# EAGLE design Peripherals (EAGLE 9.0.0)
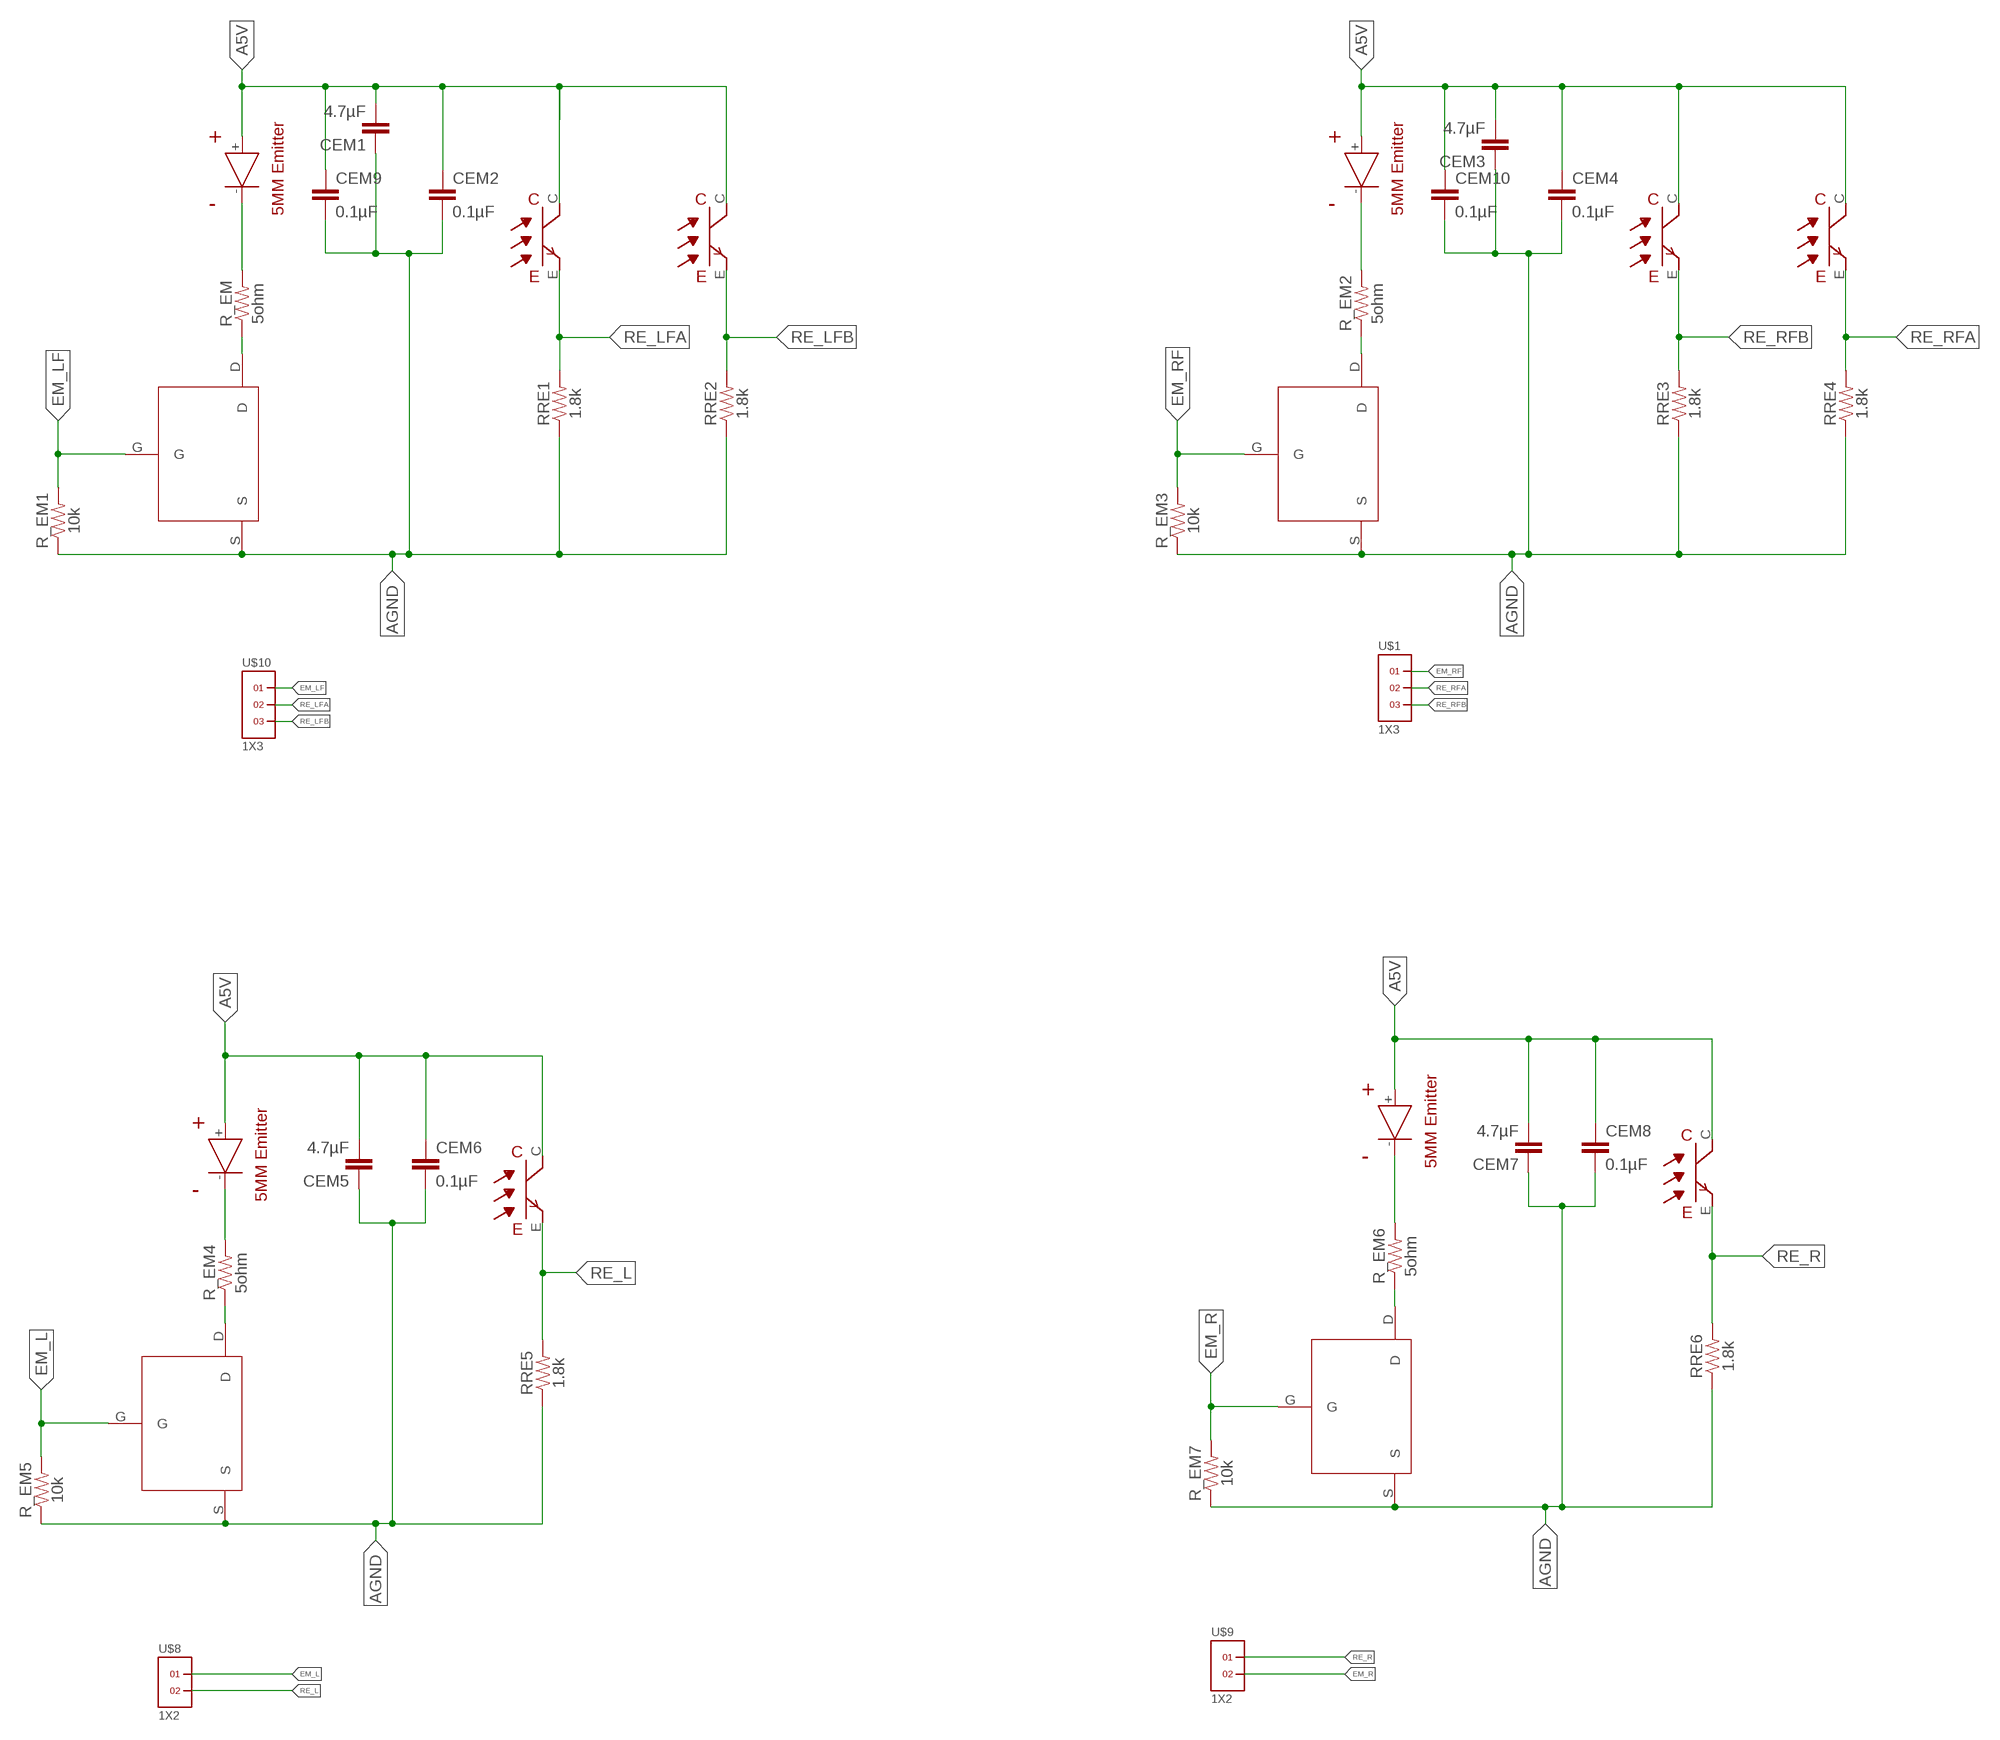
[diagram p0: schematic, sheet 1, part 1 of 2]
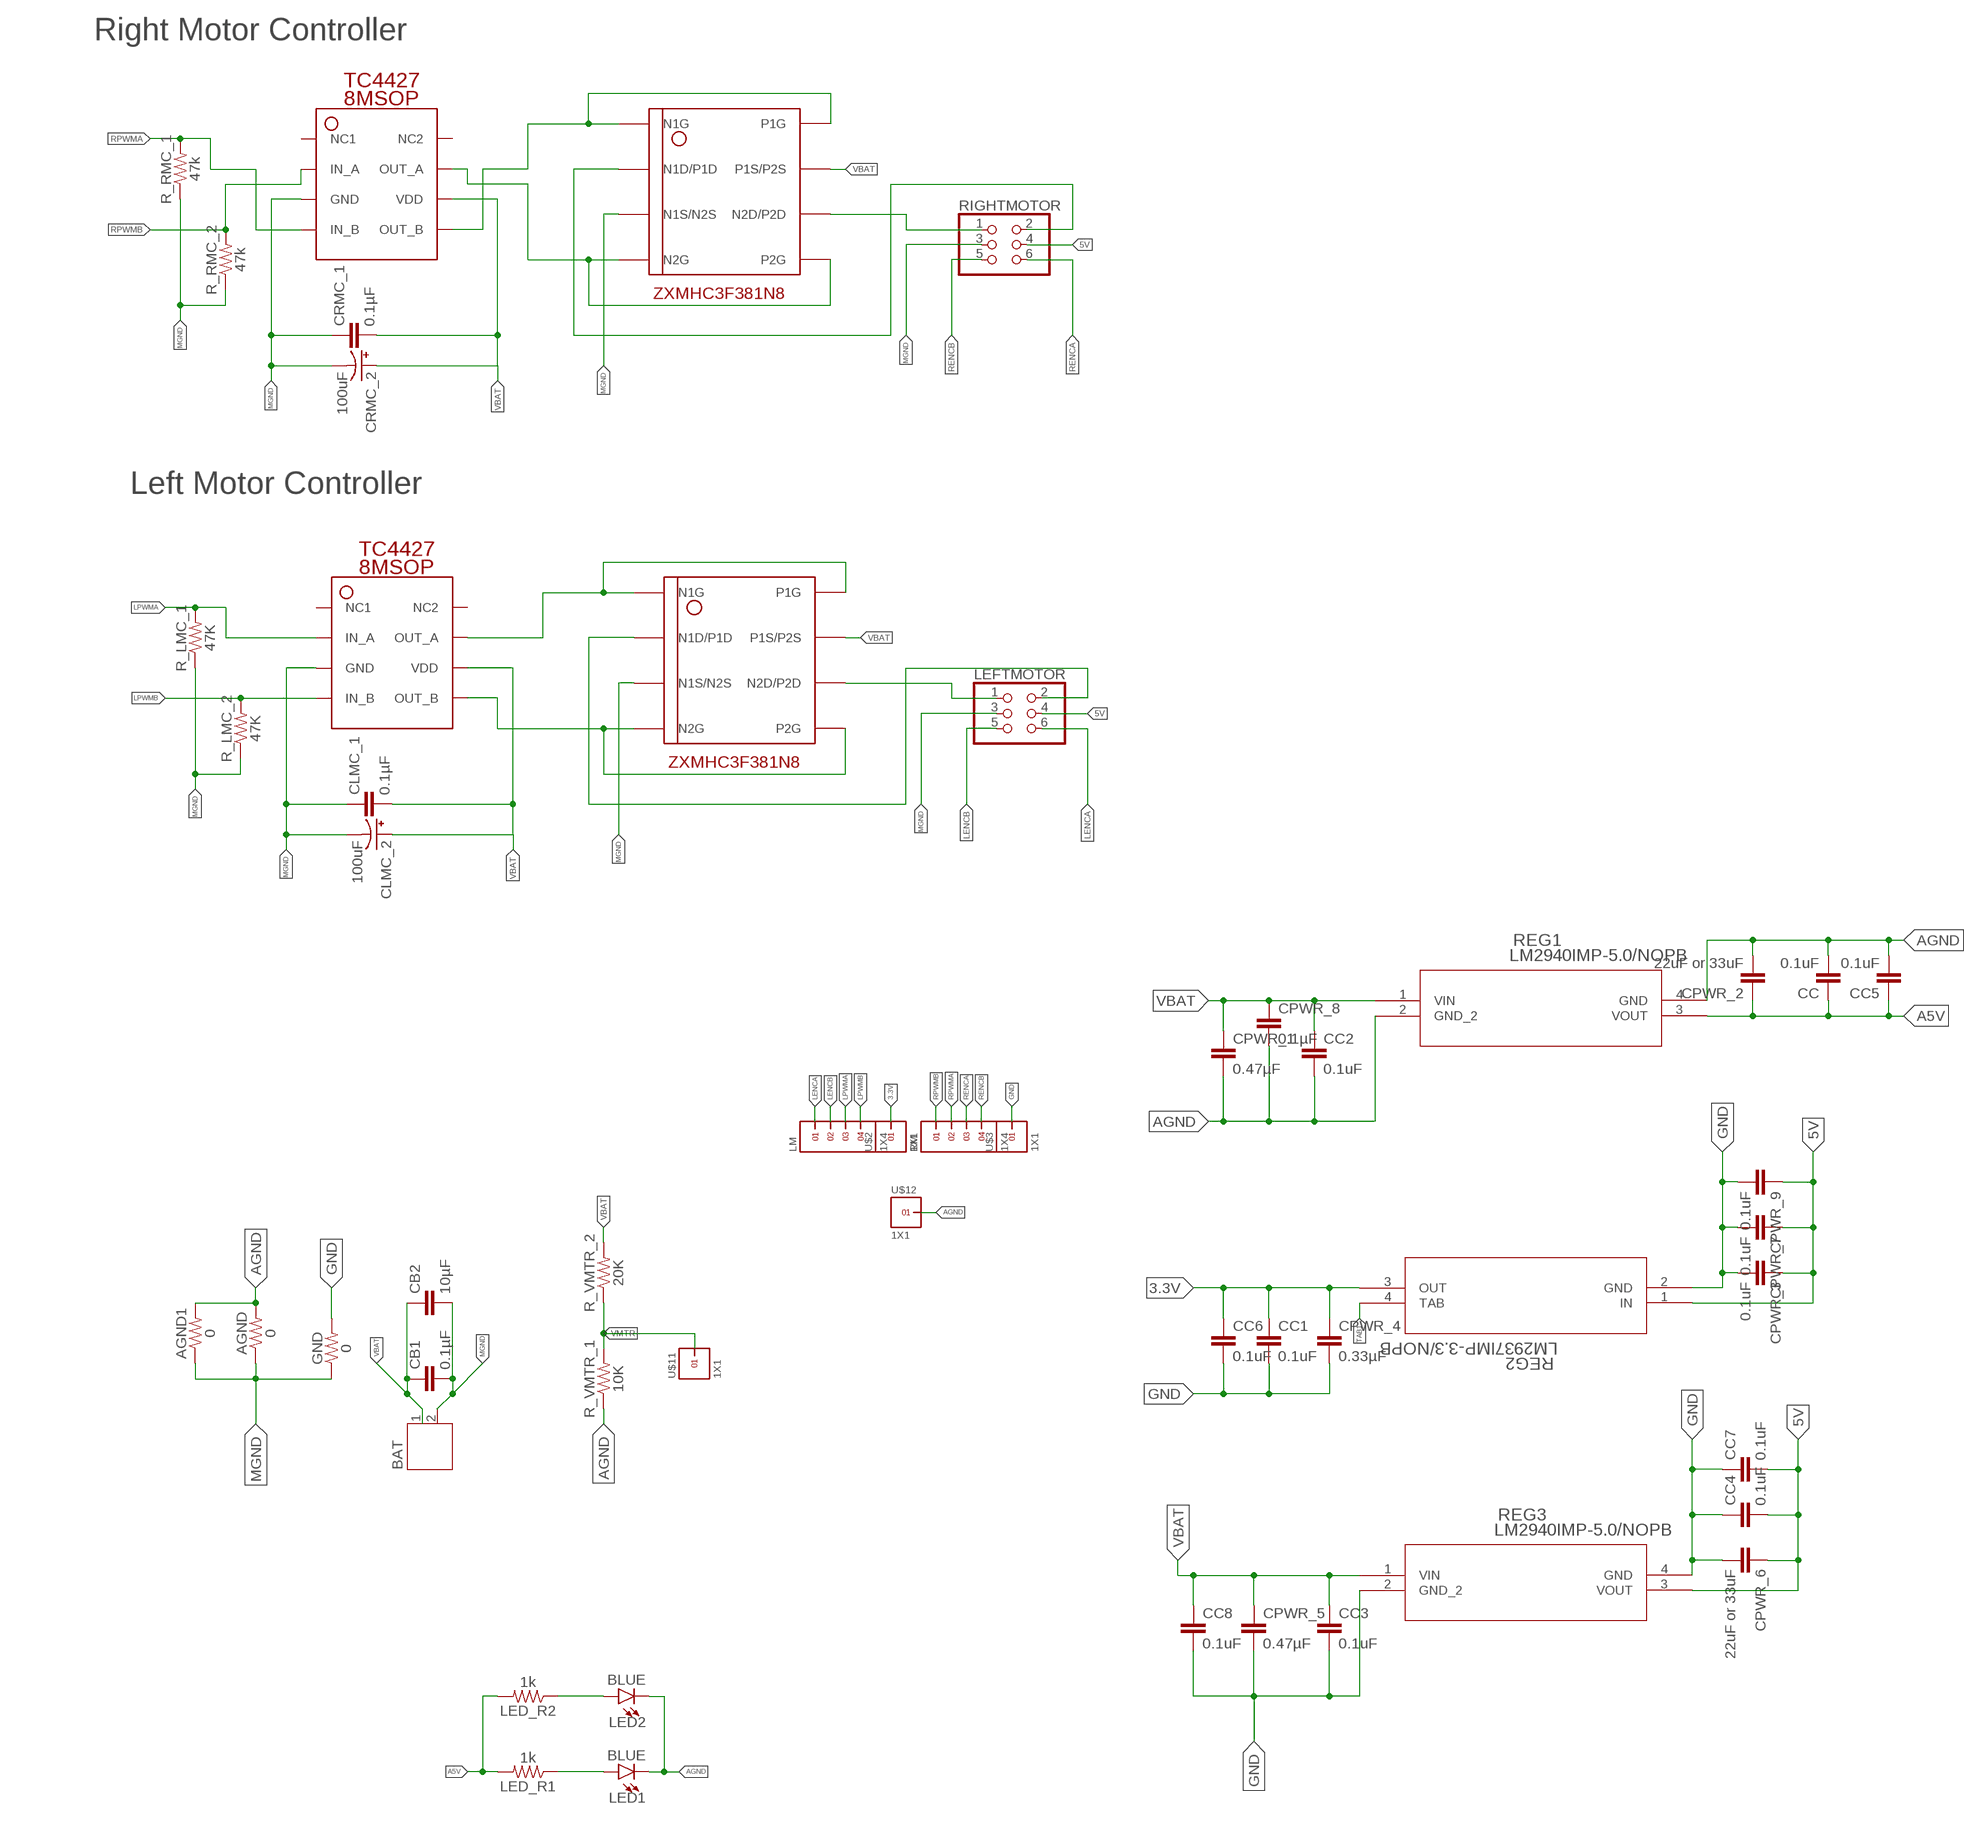
[diagram p1: schematic, sheet 1, part 2 of 2]

## Parts
AGND  0  0.75OHM-0805-1/4W-1%  [0805]
AGND1  0  0.75OHM-0805-1/4W-1%  [0805]
BAT  JST-PH2  [JST-PH2]
CB1  0.1µF  0.33UF/330NF-0805-50V-10%  [0805]
CB2  10µF  0.33UF/330NF-0805-50V-10%  [0805]
CC  0.1uF  0.33UF/330NF-0805-50V-10%  [0805]
CC1  0.1uF  0.33UF/330NF-0805-50V-10%  [0805]
CC2  0.1uF  0.33UF/330NF-0805-50V-10%  [0805]
CC3  0.1uF  0.33UF/330NF-0805-50V-10%  [0805]
CC4  0.1uF  0.33UF/330NF-0805-50V-10%  [0805]
CC5  0.1uF  0.33UF/330NF-0805-50V-10%  [0805]
CC6  0.1uF  0.33UF/330NF-0805-50V-10%  [0805]
CC7  0.1uF  0.33UF/330NF-0805-50V-10%  [0805]
CC8  0.1uF  0.33UF/330NF-0805-50V-10%  [0805]
CEM1  4.7µF  0.33UF/330NF-0805-50V-10%  [0805]
CEM2  0.1µF  0.33UF/330NF-0805-50V-10%  [0805]
CEM3  4.7µF  0.33UF/330NF-0805-50V-10%  [0805]
CEM4  0.1µF  0.33UF/330NF-0805-50V-10%  [0805]
CEM5  4.7µF  0.33UF/330NF-0805-50V-10%  [0805]
CEM6  0.1µF  0.33UF/330NF-0805-50V-10%  [0805]
CEM7  4.7µF  0.33UF/330NF-0805-50V-10%  [0805]
CEM8  0.1µF  0.33UF/330NF-0805-50V-10%  [0805]
CEM9  0.1µF  0.33UF/330NF-0805-50V-10%  [0805]
CEM10  0.1µF  0.33UF/330NF-0805-50V-10%  [0805]
CLMC_1  0.1µF  0.33UF/330NF-0805-50V-10%  [0805]
CLMC_2  100uF  100UF-POLAR-EIA7343-10V-10%(TANT)  [EIA7343]
CPWR_1  0.47µF  0.33UF/330NF-0805-50V-10%  [0805]
CPWR_2  22uF or 33uF  0.33UF/330NF-0805-50V-10%  [0805]
CPWR_3  0.1uF  0.33UF/330NF-0805-50V-10%  [0805]
CPWR_4  0.33µF  0.33UF/330NF-0805-50V-10%  [0805]
CPWR_5  0.47µF  0.33UF/330NF-0805-50V-10%  [0805]
CPWR_6  22uF or 33uF  0.33UF/330NF-0805-50V-10%  [0805]
CPWR_7  0.1uF  0.33UF/330NF-0805-50V-10%  [0805]
CPWR_8  0.1µF  0.33UF/330NF-0805-50V-10%  [0805]
CPWR_9  0.1uF  0.33UF/330NF-0805-50V-10%  [0805]
CRMC_1  0.1µF  0.33UF/330NF-0805-50V-10%  [0805]
CRMC_2  100uF  100UF-POLAR-EIA7343-10V-10%(TANT)  [EIA7343]
EM_L  EMITTER  [EMITTER]
EM_LF  EMITTER  [EMITTER]
EM_R  EMITTER  [EMITTER]
EM_RF  EMITTER  [EMITTER]
GND  0  0.75OHM-0805-1/4W-1%  [0805]
LED1  BLUE  LED-BLUE1206  [LED-1206]
LED2  BLUE  LED-BLUE1206  [LED-1206]
LED_R1  1k  0.75OHM-0805-1/4W-1%  [0805]
LED_R2  1k  0.75OHM-0805-1/4W-1%  [0805]
LEFTMOTOR  PINHD-2X3  [2X03]
LM  1X4  [1X4]
R_EM  5ohm  0.75OHM-0805-1/4W-1%  [0805]
R_EM1  10k  0.75OHM-0805-1/4W-1%  [0805]
R_EM2  5ohm  0.75OHM-0805-1/4W-1%  [0805]
R_EM3  10k  0.75OHM-0805-1/4W-1%  [0805]
R_EM4  5ohm  0.75OHM-0805-1/4W-1%  [0805]
R_EM5  10k  0.75OHM-0805-1/4W-1%  [0805]
R_EM6  5ohm  0.75OHM-0805-1/4W-1%  [0805]
R_EM7  10k  0.75OHM-0805-1/4W-1%  [0805]
R_LMC_1  47K  0.75OHM-0805-1/4W-1%  [0805]
R_LMC_2  47K  0.75OHM-0805-1/4W-1%  [0805]
R_RMC_1  47k  0.75OHM-0805-1/4W-1%  [0805]
R_RMC_2  47k  0.75OHM-0805-1/4W-1%  [0805]
R_VMTR_1  10K  0.75OHM-0805-1/4W-1%  [0805]
R_VMTR_2  20K  0.75OHM-0805-1/4W-1%  [0805]
RE_L  RECEIVER  [RECEIVER]
RE_LFA  RECEIVER  [RECEIVER]
RE_LFB  RECEIVER  [RECEIVER]
RE_R  RECEIVER  [RECEIVER]
RE_RFA  RECEIVER  [RECEIVER]
RE_RFB  RECEIVER  [RECEIVER]
REG1  LM2940IMP-5.0/NOPB  [MP04A]
REG2  LM2937IMP-3.3/NOPB  [MP04A]
REG3  LM2940IMP-5.0/NOPB  [MP04A]
RIGHTMOTOR  PINHD-2X3  [2X03]
RM  1X4  [1X4]
RRE1  1.8k  0.75OHM-0805-1/4W-1%  [0805]
RRE2  1.8k  0.75OHM-0805-1/4W-1%  [0805]
RRE3  1.8k  0.75OHM-0805-1/4W-1%  [0805]
RRE4  1.8k  0.75OHM-0805-1/4W-1%  [0805]
RRE5  1.8k  0.75OHM-0805-1/4W-1%  [0805]
RRE6  1.8k  0.75OHM-0805-1/4W-1%  [0805]
U$1  1X3  [1X3]
U$2  1X1  [1X1]
U$3  1X1  [1X1]
U$4  MCH3474  [MCH3474]
U$5  MCH3474  [MCH3474]
U$6  MCH3474  [MCH3474]
U$7  MCH3474  [MCH3474]
U$8  1X2  [1X2]
U$9  1X2  [1X2]
U$10  1X3  [1X3]
U$11  1X1  [1X1]
U$12  1X1  [1X1]
U$15  TC4427(8MSOP)  [TC4427(8MSOP)]
U$16  ZXMHC3F381N8  [ZXMHC3F381N8]
U$17  TC4427(8MSOP)  [TC4427(8MSOP)]
U$18  ZXMHC3F381N8  [ZXMHC3F381N8]

## Nets
3.3V: CC1.1 CC6.1 CPWR_4.1 REG2.3(OUT) U$2.1
5V: CC4.2 CC7.2 CPWR_3.1 CPWR_6.1 CPWR_7.1 CPWR_9.1 LEFTMOTOR.4 REG2.1(IN) REG3.3(VOUT) RIGHTMOTOR.4
A5V: CC5.1 CC.1 CEM1.2 CEM2.1 CEM3.2 CEM4.1 CEM5.2 CEM6.1 CEM7.2 CEM8.1 CEM9.1 CEM10.1 CPWR_2.1 EM_L.+ EM_LF.+ EM_R.+ EM_RF.+ LED_R1.2 LED_R2.2 RE_L.C RE_LFA.C RE_LFB.C RE_R.C RE_RFA.C RE_RFB.C REG1.3(VOUT)
AGND: AGND1.2 AGND.2 CC2.2 CC5.2 CC.2 CEM1.1 CEM2.2 CEM3.1 CEM4.2 CEM5.1 CEM6.2 CEM7.1 CEM8.2 CEM9.2 CEM10.2 CPWR_1.2 CPWR_2.2 CPWR_8.2 LED1.C LED2.C R_EM1.1 R_EM3.1 R_EM5.1 R_EM7.1 R_VMTR_1.1 REG1.2(GND_2) REG1.4(GND) RRE1.1 RRE2.1 RRE3.1 RRE4.1 RRE5.1 RRE6.1 U$4.S U$5.S U$6.S U$7.S U$12.1
EM_L: R_EM5.2 U$4.G U$8.1
EM_LF: R_EM1.2 U$5.G U$10.1
EM_R: R_EM7.2 U$7.G U$9.2
EM_RF: R_EM3.2 U$1.1 U$6.G
EMD_L: EM_L.- R_EM4.2
GND: CC1.2 CC3.2 CC4.1 CC6.2 CC7.1 CC8.2 CPWR_3.2 CPWR_4.2 CPWR_5.2 CPWR_6.2 CPWR_7.2 CPWR_9.2 GND.2 REG2.2(GND) REG3.2(GND_2) REG3.4(GND) U$3.1
L: LEFTMOTOR.2 U$16.N1D/P1D
LENCA: LEFTMOTOR.6 LM.1
LENCB: LEFTMOTOR.5 LM.2
LPWMA: LM.3 R_LMC_1.2 U$15.IN_A
LPWMB: LM.4 R_LMC_2.2 U$15.IN_B
MGND: AGND1.1 AGND.1 BAT.2 CB1.2 CB2.2 CLMC_1.1 CLMC_2.C(-) CRMC_1.1 CRMC_2.C(-) GND.1 LEFTMOTOR.3 R_LMC_1.1 R_LMC_2.1 R_RMC_1.1 R_RMC_2.1 RIGHTMOTOR.3 U$15.GND U$16.N1S/N2S U$17.GND U$18.N1S/N2S
N$1: R_EM.1 U$5.D
N$2: R_EM2.1 U$6.D
N$3: R_EM4.1 U$4.D
N$4: R_EM6.1 U$7.D
N$5: EM_LF.- R_EM.2
N$6: EM_RF.- R_EM2.2
N$7: EM_R.- R_EM6.2
N$8: LED1.A LED_R1.1
N$9: LEFTMOTOR.1 U$16.N2D/P2D
N$10: LED2.A LED_R2.1
N$36: RIGHTMOTOR.1 U$18.N2D/P2D
OUT_A: U$15.OUT_A U$16.N1G U$16.P1G
OUT_B: U$15.OUT_B U$16.N2G U$16.P2G
OUTA: U$17.OUT_B U$18.N1G U$18.P1G
OUTB: U$17.OUT_A U$18.N2G U$18.P2G
R: RIGHTMOTOR.2 U$18.N1D/P1D
RE_L: RE_L.E RRE5.2 U$8.2
RE_LFA: RE_LFA.E RRE1.2 U$10.2
RE_LFB: RE_LFB.E RRE2.2 U$10.3
RE_R: RE_R.E RRE6.2 U$9.1
RE_RFA: RE_RFB.E RRE4.2 U$1.2
RE_RFB: RE_RFA.E RRE3.2 U$1.3
RENCA: RIGHTMOTOR.6 RM.3
RENCB: RIGHTMOTOR.5 RM.4
RPWMA: R_RMC_1.2 RM.2 U$17.IN_B
RPWMB: R_RMC_2.2 RM.1 U$17.IN_A
TAB1: REG2.4(TAB)
VBAT: BAT.1 CB1.1 CB2.1 CC2.1 CC3.1 CC8.1 CLMC_1.2 CLMC_2.A(+) CPWR_1.1 CPWR_5.1 CPWR_8.1 CRMC_1.2 CRMC_2.A(+) R_VMTR_2.2 REG1.1(VIN) REG3.1(VIN) U$15.VDD U$16.P1S/P2S U$17.VDD U$18.P1S/P2S
VMTR: R_VMTR_1.2 R_VMTR_2.1 U$11.1
Unconnected: U$15.NC1 U$15.NC2 U$17.NC1 U$17.NC2

## Notes on the sheet
- Right Motor Controller
- Left Motor Controller

## Library data of the parts
AGND AGND1 GND LED_R1 LED_R2 R_EM R_EM1-R_EM7 R_LMC_1 R_LMC_2 R_RMC_1 R_RMC_2 R_VMTR_1 R_VMTR_2 RRE1-RRE6 = SparkFun-Resistors:0.75OHM: 0.75Ω resistor A resistor is a passive two-terminal electrical component that implements electrical resistance as a circuit element. Resistors act to reduce current flow, and, at the same time, act to lower voltage levels within circuits. - Wikipedia; PROD_ID: RES-08474; VALUE: 0.75
BAT = jst-ph:JST-PH2
CB1 CB2 CC CC1-CC8 CEM1-CEM10 CLMC_1 CPWR_1-CPWR_3 CPWR_5-CPWR_9 CRMC_1 = SparkFun-Capacitors:0.33UF/330NF: 0.33µF/330nF ceramic capacitors A capacitor is a passive two-terminal electrical component used to store electrical energy temporarily in an electric field.; PROD_ID: CAP-08469; VALUE: 0.33µF
CLMC_2 CRMC_2 = SparkFun-Capacitors:100UF-POLAR: 100µF polarized capacitors A capacitor is a passive two-terminal electrical component used to store electrical energy temporarily in an electric field.; PROD_ID: CAP-07890
CPWR_4 = SparkFun-Capacitors:0.33UF/330NF: 0.33µF/330nF ceramic capacitors A capacitor is a passive two-terminal electrical component used to store electrical energy temporarily in an electric field.; PROD_ID: CAP-08469
EM_L EM_LF EM_R EM_RF = sfh4550 & teft4300:EMITTER
LED1 LED2 = SparkFun-LED:LED-BLUE: Blue SMD LED Used in manufacturing of various products at SparkFun Packages: 0603 - SMD 0603 package [Product Link] <http://www.digikey.com/product-detail/en/SMLE12BC7TT86/511-1589-2-ND/1641808> 1206 - SMD1206 package [Product Link] <http://www.digikey.com/product-detail/en/lite-on-inc/LTST-C150TBKT/160-1643-1-ND/573584> SparkFun Products: ESP8266 Thing-Dev Board <https://www.sparkfun.com/products/13711> RedBoard <https://www.sparkfun.com/products/12757>; PROD_ID: DIO-09911
LEFTMOTOR RIGHTMOTOR = pinhead:PINHD-2X3: PIN HEADER
LM RM = headers(2mm):1X4
RE_L RE_LFA RE_LFB RE_R RE_RFA RE_RFB = sfh4550 & teft4300:RECEIVER
REG1 REG3 = LM2940IMP-5.0:LM2940IMP-5.0/NOPB; 3D_LIBRARY_NAME: National_LDO; BASE_PN: LM2940; COMP: TypeLDO; COPYRIGHT: Copyright C 2015 Accelerated Designs. All rights reserved; LIBRARY: ReferenceLM2940IMP; MANUFACTURER_PART_NUMBER: LM2940IMP5.0NOPB; PIN: Count4; SYMBOL: NameLM2940IMP50; TYPE: LM2940IMP5.0; VENDOR: National Semiconductor; VERSION: 1
REG2 = LM2937IMP-3.3:LM2937IMP-3.3/NOPB; COPYRIGHT: Copyright C 2015 Accelerated Designs. All rights reserved; MANUFACTURER_PART_NUMBER: lm2937imp3_3nopb; VENDOR: National Semiconductor
U$1 U$10 = headers(2mm):1X3
U$2 U$3 U$11 U$12 = headers(2mm):1X1
U$4-U$7 = MCH3474:MCH3474
U$8 U$9 = headers(2mm):1X2
U$15 U$17 = TC4427(8MSOP):TC4427(8MSOP)
U$16 U$18 = ZXMHC3F381N8:ZXMHC3F381N8

## Board
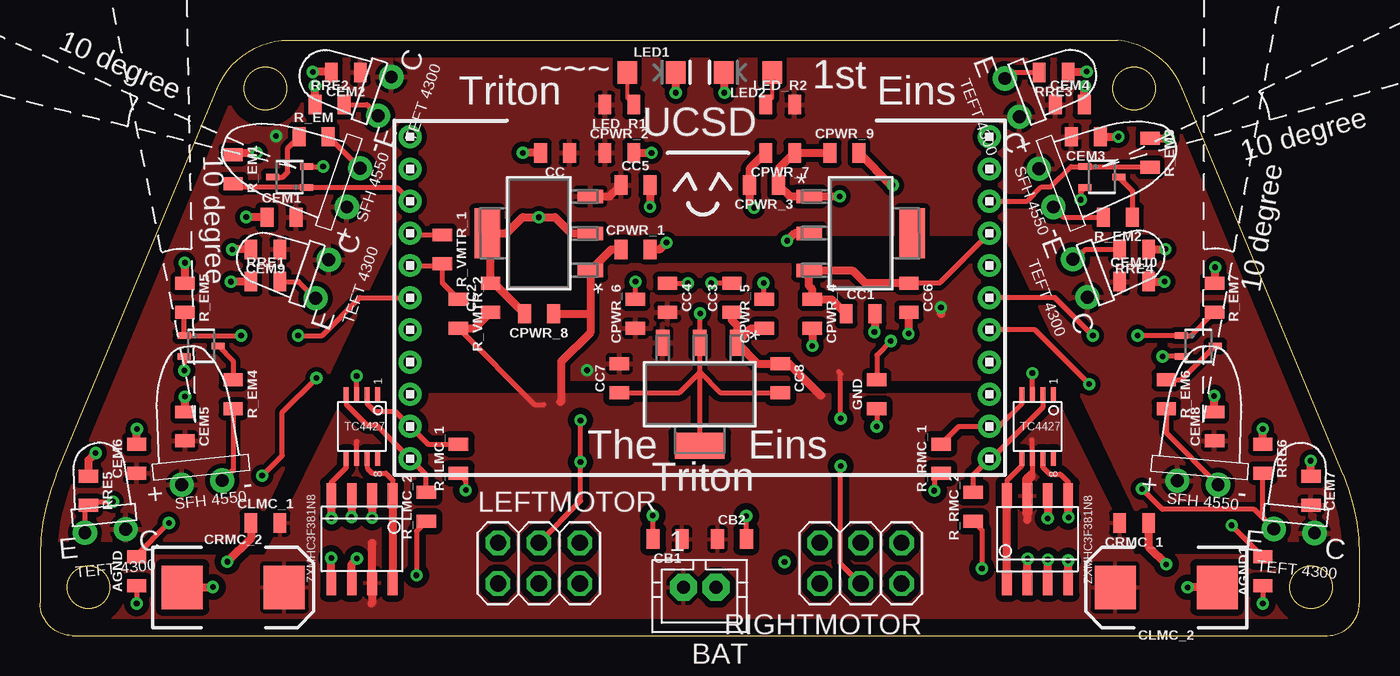
[diagram p2: board, top side]
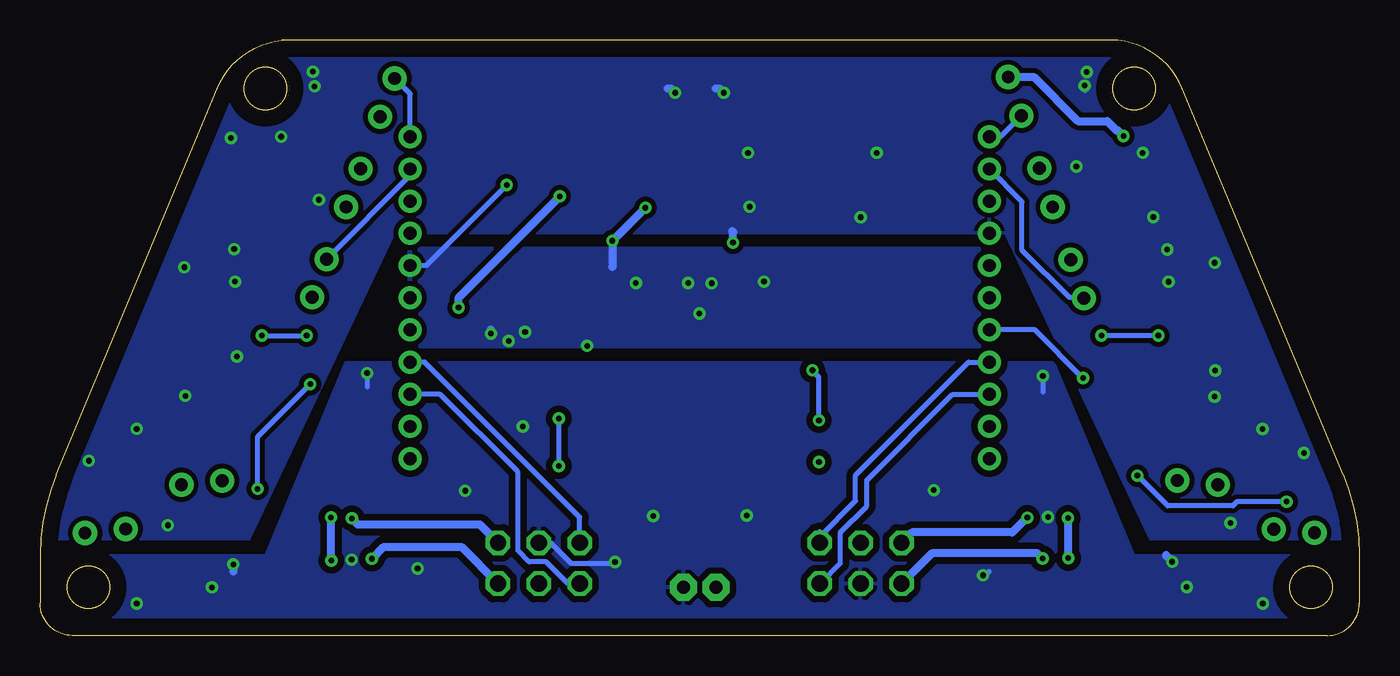
[diagram p3: board, bottom side, seen from below]

Size 82 x 37 mm. Coordinates in mm from the lower left corner, seen from the top.
Outline: 2,0 80,0 arc90 82,2 82,5 arc23 81,10 71,34 arc61 67,37 15,37 arc61 11,34 1,10 arc23 0,5 0,2 arc90 2,0
Outline: circle at 14,34 radius 1.3
Outline: circle at 68,34 radius 1.3
Outline: circle at 3,3 radius 1.3
Outline: circle at 79,3 radius 1.3
Copper layers (1*16): Top 0.035mm / dielectric 1.5mm / Bottom 0.035mm
Design rules "default": minimum track width 6mil, minimum drill 0.35mm, track to track 6mil, track to pad 6mil, pad to pad 6mil, via to via 6mil, smd to smd 6mil, copper to edge 40mil, drill to drill 6mil, minimum pad ring 10mil, minimum via ring 8mil, stop-mask expansion 4mil, vias tented up to drill 0mil, thermal gap 10mil

### Footprints (pad centres in the part's own frame; a part is rotated, then mirrored left to right if it is on the bottom)
0805 = smd 0.8 x 1.2: 1 -0.9,0; 2 0.9,0
JST-PH2 = drill 0.813 pad 1.676 octagon: 1 1,0; 2 -1,0
EIA7343 = smd 2.55 x 2.7: A 3.17,0; C -3.17,0
EMITTER = drill 0.8 pad 1.5: + -1.27,-0.5; - 1.27,-0.5
LED-1206 = smd 1.2 x 1.4: A -1.5,0; C 1.5,0
2X03 = drill 1.016 octagon: 1 -2.54,-1.27; 2 -2.54,1.27; 3 0,-1.27; 4 0,1.27; 5 2.54,-1.27; 6 2.54,1.27
1X4 = drill 0.8 pad 1.422: 1 -3,0; 2 -1,0; 3 1,0; 4 3,0
RECEIVER = drill 0.8 pad 1.5: C 1.27,-0.5; E -1.27,-0.5
MP04A = smd 1.6 x 0.838: 1 -3.2,2.3; 2 -3.2,0; 3 -3.2,-2.3 | smd 1.6 x 3.099: 4 3.2,0
1X3 = drill 0.8 pad 1.422: 1 -2,0; 2 0,0; 3 2,0
1X1 = drill 0.8 pad 1.422: 1 0,0
MCH3474 = smd 0.406 x 0.813: D 0,1.05; G -0.65,-1.05; S 0.65,-1.05
1X2 = drill 0.8 pad 1.422: 1 -1,0; 2 1,0
TC4427(8MSOP) = smd 0.95 x 0.3: GND -1.975,-0.325; IN_A -1.975,0.325; IN_B -1.975,-0.975; NC1 -1.975,0.975; NC2 1.975,0.975; OUT_A 1.975,0.325; OUT_B 1.975,-0.975; VDD 1.975,-0.325
ZXMHC3F381N8 = smd 0.6 x 1.55: N1D/P1D -0.635,-2.7; N1G -1.905,-2.7; N1S/N2S 0.635,-2.7; N2D/P2D 0.635,2.7; N2G 1.905,-2.7; P1G -1.905,2.7; P1S/P2S -0.635,2.7; P2G 1.905,2.7

### Placement (x,y rotation side)
AGND  6,4 90 top
AGND1  76,4 90 top
BAT  41,3 180 top
CB1  39,6 180 top
CB2  43,6 0 top
CC  32,30 180 top
CC1  51,20 0 top
CC2  28,21 90 top
CC3  43,21 90 top
CC4  39,21 270 top
CC5  37,28 0 top
CC6  54,21 270 top
CC7  36,16 90 top
CC8  46,16 270 top
CEM1  15,26 0 top
CEM2  19,35 180 top
CEM3  65,31 180 top
CEM4  64,33 0 top
CEM5  9,13 270 top
CEM6  6,11 90 top
CEM7  79,9 270 top
CEM8  73,13 90 top
CEM9  14,24 180 top
CEM10  68,22 0 top
CLMC_1  14,7 0 top
CLMC_2  70,3 180 top
CPWR_1  37,24 0 top
CPWR_2  36,30 0 top
CPWR_3  45,28 180 top
CPWR_4  48,20 270 top
CPWR_5  45,20 90 top
CPWR_6  37,20 90 top
CPWR_7  46,30 180 top
CPWR_8  31,20 180 top
CPWR_9  50,30 0 top
CRMC_1  68,7 180 top
CRMC_2  12,3 0 top
EM_L  10,10 6.2 top
EM_LF  19,28 71.1 top
EM_R  72,10 354.8 top
EM_RF  63,28 290.7 top
GND  52,15 90 top
LED1  38,35 0 top
LED2  44,35 180 top
LED_R1  3k  [0805]  36,33 180 top
LED_R2  3k  [0805]  46,33 0 top
LEFTMOTOR  31,4.5 0 top
LM  23,14 270 top
R_EM  17,31 0 top
R_EM1  12,28.99 270 top
R_EM2  67,26 180 top
R_EM3  69,30 270 top
R_EM4  12,15 270 top
R_EM5  9,21 270 top
R_EM6  70,15 270 top
R_EM7  73,21 270 top
R_LMC_1  26,11 90 top
R_LMC_2  24,8 90 top
R_RMC_1  56,11 90 top
R_RMC_2  58,8 90 top
R_VMTR_1  25,24 270 top
R_VMTR_2  26,20 270 top
RE_L  4,7 5.4 top
RE_LFA  17.06,22.32 71.1 top
RE_LFB  20.94,33.68 71.1 top
RE_R  78,7 354.3 top
RE_RFA  60.88,33.61 290.7 top
RE_RFB  65.12,22.39 290.7 top
REG1  31,25 180 top
REG2  51,25 0 top
REG3  41,15 270 top
RIGHTMOTOR  51,4.5 180 top
RM  59,14 90 top
RRE1  ~500ohm  [0805]  14,22 0 top
RRE2  ~500ohm  [0805]  18,33 0 top
RRE3  ~500ohm  [0805]  63,35 180 top
RRE4  ~500ohm  [0805]  68,24 180 top
RRE5  ~600ohm  [0805]  3,9 270 top
RRE6  ~600ohm  [0805]  76,11 270 top
U$1  59,29 90 top
U$2  59,25 0 top
U$3  59,23 0 top
U$4  10,18 270 top
U$5  15.5,28.5 90 top
U$6  66,28.5 270 top
U$7  72,18 270 top
U$8  23,20 270 top
U$9  59,20 90 top
U$10  23,29 90 top
U$11  23,23 0 top
U$12  23,25 0 top
U$15  20,13 270 top
U$16  20,6 180 top
U$17  62,13 270 top
U$18  62,6 0 top

### Tracks (layer width: path | path; a pad name or v marks a point on that pad's centre or on a via)
3.3V
  Top 0.305: U$2.1 55.9,21.9 CC6.1
  Top 0.508: REG2.3 47.79,21.72 48,21.51 CPWR_4.1 49.2,20.9 CC1.1 | REG2.3 | CC6.1 51.29,21.9 50.53,22.66 47.82,22.66 REG2.3
5V  (via drill 0.35)
  Top 0.305: LEFTMOTOR.4 33.6,8.37 v33.6,10.78 v33.59,10.79 v33.59,13.38 | RIGHTMOTOR.4 49.75,4.48 v49.75,10.53 v49.76,10.54 | v49.76,13.49 49.76,16.27 49.63,16.4
  Top 0.508: v49.7,27.3 REG2.1 46.6,27.3 CPWR_3.1 45.9,29 CPWR_7.1 CPWR_9.1 | v55.99,20.39 55.99,20.01 56,20
  Bottom 0.305: v49.76,10.54 v49.76,13.49 | v33.59,13.38 33.59,16.07 33.99,16.47 v33.99,16.49
  Bottom 0.508: v55.99,20.39 55.99,21.01 v49.7,27.3
  pour Top (isolate 0.305): 19,16 63,16 60,23 22,23
A5V  (via drill 0.35)
  Top 0.508: REG1.3 35.4,27.3 CC5.1
  Bottom 0.508: RE_LFB.C 20.24,34.72 17.49,31.97 15.66,31.97 15.08,31.39 15,31.39 v14.66,31.05
  pour Top (isolate 0.305): -4,6 13,6 22,25 60,25 69,6 84,6 70,38 11,38
AGND  (via drill 0.35)
  Top 0.305: AGND.2 6,5 v8,7 | AGND1.2 74.07,6.83 v74.07,6.86 | U$4.S 8.95,16.63 v8.96,16.48 | U$5.S v17.59,29.15 | U$7.S v69.77,17.35 | U$6.S 64.68,27.58 v64.68,27.09 | U$12.1 23.1,24.9 R_VMTR_1.1
  Top 0.508: CC.2 v30,30 | CPWR_2.2 v38,30 | RRE5.1 3,10.91 v3.44,11.35 | CEM6.2 v6,12.83 v6.01,12.84 | CEM5.1 v9,14.85 | R_EM5.1 9,22.75 v8.99,23.17 | RRE1.1 12.23,22 v11.86,21.99 | CEM9.2 v11.94,24 | CEM1.1 13.25,26 v12.8,26.01 | R_EM1.1 12.11,30 v13.46,30 | RRE2.1 17.1,34.01 v17.08,34.18 | CEM2.2 18.07,35.03 v16.94,35.03 16.85,34.94 | RRE3.1 63.95,35.05 v65.05,35.05 | 64.94,33.04 CEM4.2 64.9,34.08 v64.95,34.13 | CEM3.1 v67.02,31 | RRE4.1 68.92,24.02 v69.94,24.02 | CEM10.2 v69.89,22 | R_EM7.1 73.04,21.94 v73.04,22.89 | CEM8.2 72.98,13.92 v72.98,14.9 | RRE6.1 v76,12.85 | CEM7.1 78.98,9.92 v78.98,10.87 | REG1.4 28,25 | 28,25 29,25 30,26 v31,26 32,26 33,25 REG1.2 | CPWR_1.2 37.92,24.02 | CPWR_8.2 28.2,21.9 CC2.2 28,25 | CC5.2 v37.9,26.65 | 37.92,24.02 37.96,23.98 | 37.92,24.02 38.53,24.02 v38.93,24.42 | LED1.C v39.5,33.75 v39.51,33.74 | LED2.C 42.5,33.77 v42.53,33.74 | R_EM3.1 70.12,30.9 v70.14,30.92
  Bottom 0.305: v74.07,6.86 74.07,6.93 74,7 | 9.02,22.98 9,23
  Bottom 0.508: v38.93,24.42 38.93,25.07 38.99,25.13 | v39.51,33.74 39.77,34 40,34 | v42.53,33.74 42.79,34 43,34 | v17.08,34.18 17.09,34 17,34 | v64.95,34.13 65,34.08 65,34 | v70.14,30.92 70.06,31 70,31
  pour Bottom (isolate 0.305): -4,6 13,6 22,25 60,25 69,6 84,6 82,10 70,38 12,38
EM_L  (via drill 0.35)
  Top 0.305: R_EM5.2 8.95,20.05 U$4.G v12.49,18.65 | v16.03,18.65 17.52,18.65 19.87,21 U$8.1
  Bottom 0.305: v12.49,18.65 v16.03,18.65
EM_LF
  Top 0.305: R_EM1.2 12.24,27.85 U$5.G 22.15,27.85 U$10.1
EM_R  (via drill 0.35)
  Top 0.305: R_EM7.2 71.55,18.65 U$7.G v68.22,18.65 | v65.44,18.65 63.09,21 U$9.2
  Bottom 0.305: v68.22,18.65 v65.44,18.65
EM_RF
  Top 0.305: R_EM3.2 68.95,29.15 U$6.G 64.08,29.15 62.81,27.88 62.24,27.88 61.36,27 U$1.1
EMD_L
  Top 0.305: R_EM4.2 12,10.32 EM_L.-
GND  (via drill 0.35)
  Top 0.305: REG3.4 41,16.37 | 41,16.37 REG3.2 41,20 v41.02,20.02 | CC7.1 39.73,15.1 41,16.37 | 41,16.37 42.27,15.1 CC8.2 | CPWR_6.2 v37,21.99 v37.01,22 | CC4.1 v40.26,21.9 | CC3.2 v41.72,21.91 | CPWR_5.2 45,21.88 v44.97,21.91 | v52.88,18.31 52,17.43 GND.2
  Top 0.508: CPWR_4.2 v48,18.01 | CC1.2 51.9,18.91 v51.86,18.87 | CC6.2 53.98,20.08 v53.98,18.77 | v44.38,26.59 44.1,26.87 CPWR_3.2 44.1,29 CPWR_7.2 | REG2.2 46.89,25 v46.43,24.54 | CPWR_9.2 52.9,28 v53,28
  Bottom 0.305: v53,28 58,23 U$3.1
  Bottom 0.508: v48,18.01 v48,18 | v51.86,18.87 51.99,19 52,19 | v53.98,18.77 53.98,19.02 54,19 | v44.38,26.59 v46.43,24.54 46.43,22.9
  pour Bottom (isolate 0.305): 20,18 23,24 59,24 62,18
L  (via drill 0.35)
  Top 0.508: U$16.N1D/P1D 20.63,7.48 v20.63,7.33
  Bottom 0.508: v20.63,7.33 20.62,7.37 21.57,6.42 27.81,6.42 LEFTMOTOR.2
LENCA
  Bottom 0.305: 33.54,6.46 LEFTMOTOR.6 33.54,6.14 31.31,8.37 31.31,9.98 24.29,17 LM.1
LENCB
  Bottom 0.305: LEFTMOTOR.5 32.28,4.49 32.28,6.39 30.62,8.05 30.62,9.67 25.29,15 LM.2
LPWMA
  Top 0.305: U$15.IN_A 20.33,14.4 20.79,13.93 22.07,13.93 LM.3 24.1,11.9 R_LMC_1.2
LPWMB
  Top 0.305: R_LMC_2.2 24,10 LM.4 20.89,13.11 20.28,13.11 19.02,14.37 U$15.IN_B
  Bottom 0.305: 22.95,11 LM.4
MGND  (via drill 0.35)
  Top 0.305: CB1.2 38.1,7.45 v38.08,7.47 | CB2.2 v43.9,7.42 v43.89,7.43 | R_RMC_2.1 58.54,6.56 v58.54,4.17 | R_LMC_2.1 23.39,6.49 v23.39,3.75 | GND.1 v52,13 | AGND.1 v6,2 | AGND1.1 v76,2 | U$15.GND 19.67,15.9 v19.67,16.13 | U$17.GND 61.67,15.92 v61.68,16.31 | R_RMC_1.1 55.58,9.68 v55.58,9 | R_LMC_1.1 26.45,9.65 v26.45,9.04
  Top 0.508: U$16.N1S/N2S 19.37,7.38 v19.35,7.37 | CRMC_2.C 10.71,3 v10.73,3.02 | U$18.N1S/N2S v62.64,4.72 | CLMC_2.C v71.33,3 | CLMC_1.1 13.1,6.06 v11.63,4.59 | CRMC_1.1 68.9,5.53 v70,4.43
  Bottom 0.305: RIGHTMOTOR.3 50.27,5.77 49,4.5 46.35,4.5 v46.27,4.58 | v23.39,3.75 23.25,3.75 23,4 | v19.67,16.13 19.66,15.89 19.66,15.13 | v61.68,16.31 61.67,15.92 61.67,15.44
  Bottom 0.508: v11.63,4.59 12,4.96 12,5 | v70,4.43 70,4
  pour Bottom (isolate 0.406): -4,-1 -3,5 14,5 19,17 63,17 68,5 84,5 84,-1
N$1
  Top 0.305: U$5.D 15.08,28.5 15.39,28.81 15.39,30.29 R_EM.1
N$2
  Top 0.305: U$6.D 67.9,27.65 R_EM2.1
N$3
  Top 0.305: U$4.D 12,17.05 R_EM4.1
N$4
  Top 0.305: R_EM6.1 70.95,15.9 U$7.D
N$5
  Top 0.305: R_EM.2 17.92,31 EM_LF.-
N$6
  Top 0.305: EM_RF.- 63.62,26 R_EM2.2
N$7
  Top 0.305: R_EM6.2 70,12.61 EM_R.-
N$8
  Top 0.254: LED_R1.1 36.5,33.4 LED1.A
N$9  (via drill 0.35)
  Top 0.508: U$16.N2D/P2D 19.37,4.47 v19.69,4.79
  Bottom 0.508: v19.69,4.79 20.01,5.11 26.58,5.11 LEFTMOTOR.1
N$10
  Top 0.254: LED2.A 45.5,33.4 LED_R2.1
N$36  (via drill 0.35)
  Top 0.508: U$18.N2D/P2D 62.64,7.45 v62.63,7.29
  Bottom 0.508: RIGHTMOTOR.1 54.67,6.9 62.24,6.9 v62.63,7.29
OUT_A
  Top 0.305: 20.33,10.58 U$15.OUT_A 20.33,10.41 20.63,10.1 21.48,10.1 21.91,9.67 21.91,9.66 U$16.N1G
  Top 0.508: U$16.N1G U$16.P1G
OUT_B  (via drill 0.35)
  Top 0.305: U$16.N2G 18.09,9.51 19.02,10.44 U$15.OUT_B
  Top 0.508: U$16.P2G v18.09,4.81 v18.09,4.82 | v18.11,7.31 18.11,8.69 U$16.N2G
  Bottom 0.508: v18.09,4.82 18.09,7.29 v18.11,7.31
OUTA
  Top 0.305: U$17.OUT_B 61.03,10.56 60.09,9.63 U$18.P1G
  Top 0.508: U$18.N1G U$18.P1G
OUTB  (via drill 0.35)
  Top 0.305: 62.33,10.55 U$17.OUT_A 62.33,10.47 62.75,10.04 63.41,10.04 63.91,9.55 U$18.P2G
  Top 0.508: U$18.N2G v63.91,4.66 v63.9,4.67 | v63.92,7.35 63.92,8.69 U$18.P2G
  Bottom 0.508: v63.9,4.67 63.9,7.33 v63.92,7.35
R  (via drill 0.35)
  Top 0.508: U$18.N1D/P1D 61.36,4.77 v61.38,4.78
  Bottom 0.508: v61.38,4.78 60.65,5.51 55.82,5.51 RIGHTMOTOR.2
RE_L  (via drill 0.35)
  Top 0.305: RE_L.E 2.78,7.88 RRE5.2 3.23,8.33 v4.52,8.33 | v13.8,9.94 15.05,11.19 15.05,13.89 v17.17,16.01
  Bottom 0.305: v4.52,8.33 7.6,8.33 7.86,8.07 11.91,8.07 13.78,9.94 v13.8,9.94 | v17.17,16.01 20.16,19 U$8.2
RE_LFA
  Top 0.305: RRE1.2 16.08,22 RE_LFA.E
  Bottom 0.305: RE_LFA.E 17.16,21 18,21 20.96,23.96 20.96,26.96 U$10.2
RE_LFB
  Top 0.305: RRE2.2 20.32,33 RE_LFB.E
  Bottom 0.305: RE_LFB.E 22.32,31 U$10.3
RE_R  (via drill 0.35)
  Top 0.305: RRE6.2 76,7.31 RE_R.E 75.47,7.85 69.76,7.85 v68.49,9.12 | U$9.1 61.84,19 v65.21,15.63
  Bottom 0.305: v68.49,9.12 68.49,12.35 v65.21,15.63
RE_RFA
  Top 0.305: RE_RFB.E 64.4,23.4 65,24 RRE4.2
  Bottom 0.305: RE_RFB.E 59,28.6 U$1.2
RE_RFB
  Top 0.305: RE_RFA.E 60.34,35 RRE3.2
  Bottom 0.305: U$1.3 59,33.66 RE_RFA.E
RENCA
  Bottom 0.305: 51.59,4.59 51.6,4.6 | 51.6,4.6 52.3,5.3 52.3,10.17 57.13,15 RM.3 | RIGHTMOTOR.6 49.19,3.23 50.56,4.6 51.6,4.6
RENCB
  Bottom 0.305: RIGHTMOTOR.5 48.46,7.36 58.1,17 RM.4
RPWMA
  Top 0.305: U$17.IN_B 61.03,14.38 59.64,13 RM.2 57.1,13 R_RMC_1.2
RPWMB
  Top 0.305: R_RMC_2.2 58,10 RM.1 59.13,11 62.33,14.2 U$17.IN_A
VBAT
  Top 0.305: U$15.VDD 19.67,12.05 19.66,12.07 | 61.64,12.17 61.67,12.13 U$17.VDD 61.67,10.02 61.57,9.91 | R_VMTR_2.2 30.74,14.36 31.31,14.36
  Top 0.508: CC3.1 43,19.6 43.3,19.3 REG3.1 | REG3.1 44.2,19.1 CPWR_5.1 | REG3.1 44.6,16.9 CC8.1 46.56,16.9 48.54,14.92 | 34.2,20 REG1.1 35.5,24 CPWR_1.1 | 34.2,20 34.2,18.83 32.39,17.02 32.39,14.58 32.34,14.53 | CPWR_8.1 34.2,20 | R_VMTR_2.2 27,19.1 CC2.1 | 20.61,5.77 20.63,5.74 U$16.P1S/P2S 20.63,2.05 20.6,2.01 | 61.36,7.63 61.36,7.18
  Top 0.61: U$18.P1S/P2S 61.36,7.63 | U$18.P1S/P2S 61.36,9.7 61.57,9.91
  pour Top (isolate 0.406): -4,0 -3.98,4.94 14,5 19,15 63,15 68,5 84,5 84,-1 -4,-1
VMTR
  Top 0.305: R_VMTR_2.1 25,21.9 25,23.02 | 25,23.02 R_VMTR_1.2 | U$11.1 24.98,23 25,23.02

### Text on the board
tNames: ~~~ | 1st | Triton | UCSD | Eins | The | Eins | Triton